# Altium schematic sheet BMA253_Triaxial_Acceleration_Sensor.SchDoc: BMA253 Digital Accelerometer
size A4
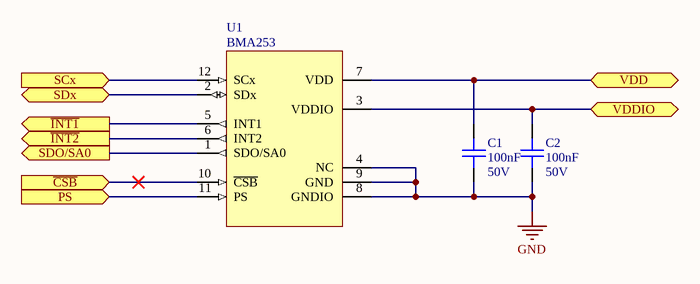
[diagram p0: BMA253_Triaxial_Acceleration_Sensor.SchDoc]

## Parts
C1  Capacitance: 100nF  Voltage: 50V  [C0402]  (hidden comment: CAP CER 0.1UF 50V X7R 0402)
C2  Capacitance: 100nF  Voltage: 50V  [C0402]  (hidden comment: CAP CER 0.1UF 50V X7R 0402)
U1  BMA253  [LGA12C50P4X4_200X200X100]

## Ports
PS (in), SCx (in), SDO/SA0 (out), SDx (bidir), VDD, VDDIO, ~{CSB} (in), ~{INT1} (out), ~{INT2} (out)

## Nets
GND: C1.1 C2.2 U1.4(NC) U1.8(GNDIO) U1.9(GND)
~{CSB}: U1.10(~{CSB}) ; port ~{CSB}
~{INT1}: U1.5(INT1) ; port ~{INT1}
~{INT2}: U1.6(INT2) ; port ~{INT2}
PS: U1.11(PS) ; port PS
SCx: U1.12(SCx) ; port SCx
SDO/SA0: U1.1(SDO/SA0) ; port SDO/SA0
SDx: U1.2(SDx) ; port SDx
VDD: C1.2 U1.7(VDD) ; port VDD
VDDIO: C2.1 U1.3(VDDIO) ; port VDDIO

## Notes on the sheet
- Title
- Size:
- Date:
- A4
- Number:
- Time:
- Revision:
- Sheet
- of
- File:

## Library data of the parts
C1 C2 = CAP CER 0.1UF 50V X7R 0402: 0.1µF ±10% 50V Ceramic Capacitor X7R 0402 (1005 Metric); Manufacturer Part Number: CGA2B3X7R1H104K050BB; Manufacturer: TDK; Supplier 1: Digi-Key; Stock 1: 2925303; Pricing 1: 1=0.17, 10=0.118, 50=0.0668, 100=0.0553, 500=0.0388, 1000=0.0321, 2500=0.0299, 5000=0.0273 (USD); Mount: Surface Mount; Case Code (Metric): 1005; Case Code (Imperial): 0402; Min Operating Temperature: -55°C; Max Operating Temperature: 125°C; Tolerance: 10%; Dielectric: X7R; Voltage Rating: 50V; Voltage Rating (DC): 50V; Packaging: Tape and Reel; Package Quantity: 1; Termination: SMD/SMT; Composition: Ceramic; Length: 1mm; Height: 0.5mm; Width: 0.02inch; Thickness: 0.022inch; Depth: 0.5mm; REACH SVHC: No SVHC; Lead Free: Lead Free; ComponentLink1URL: http://product.tdk.com/capacitor/mlcc/en/documents/mlccspec_automotive_general_midvoltage_en.pdf?src-supplier=Future+Electronics; ComponentLink1Description: http://product.tdk.com/capacitor/mlcc/en/documents/mlccspec_automotive_general_midvoltage_en.pdf?src-supplier=Future+Electronics; ComponentLink2URL: http://www.farnell.com/datasheets/1807242.pdf?src-supplier=Element14; ComponentLink2Description: http://www.farnell.com/datasheets/1807242.pdf?src-supplier=Element14; ComponentLink3URL: http://www.mouser.com/ds/2/400/lcc_automotive_general_en-843974.pdf?src-supplier=Mouser; ComponentLink3Description: http://www.mouser.com/ds/2/400/lcc_automotive_general_en-843974.pdf?src-supplier=Mouser; ComponentLink4URL: http://www.farnell.com/datasheets/1936565.pdf?src-supplier=Element14; ComponentLink4Description: http://www.farnell.com/datasheets/1936565.pdf?src-supplier=Element14; ComponentLink5URL: http://www.farnell.com/datasheets/1735392.pdf?src-supplier=Element14; ComponentLink5Description: http://www.farnell.com/datasheets/1735392.pdf?src-supplier=Element14; Supplier Part Number 1: 445-6899-1-ND; Case/Package: 0402; Weight: 2.3E-05oz; Ratings: AEC-Q200
U1 = IC BMA253 ACCEL 2-16G I2C/SPI 12LGA: Accelerometer X, Y, Z Axis ±2g, 4g, 8g, 16g 8Hz ~ 1kHz 12-LGA (2x2); Manufacturer: Bosch Sensortec; Output Type: SPI,I2C; Axis: X, Y, Z; Supplier 1: Digi-Key; Manufacturer Part Number: BMA253; Stock 1: 49895; Pricing 1: 1=1.73, 5=1.666, 10=1.353, 25=1.1656, 50=1.0094, 100=0.9158, 500=0.7701, 1000=0.6868, 5000=0.63 (USD); Mount: Surface Mount; Case/Package: LGA; Number of Pins: 12; Min Operating Temperature: -40°C; Max Operating Temperature: 85°C; Packaging: Tape and Reel; ComponentLink1URL: https://ae-bst.resource.bosch.com/media/_tech/media/application_notes/BST-MAS-HS000-05.pdf?src-supplier=Digi-Key; ComponentLink1Description: https://ae-bst.resource.bosch.com/media/_tech/media/application_notes/BST-MAS-HS000-05.pdf?src-supplier=Digi-Key; ComponentLink2URL: https://ae-bst.resource.bosch.com/media/_tech/media/application_notes/BST-MAS-HS000.pdf?src-supplier=Digi-Key; ComponentLink2Description: https://ae-bst.resource.bosch.com/media/_tech/media/application_notes/BST-MAS-HS000.pdf?src-supplier=Digi-Key; Supplier Part Number 1: 828-1071-1-ND; Bandwidth: 8Hz